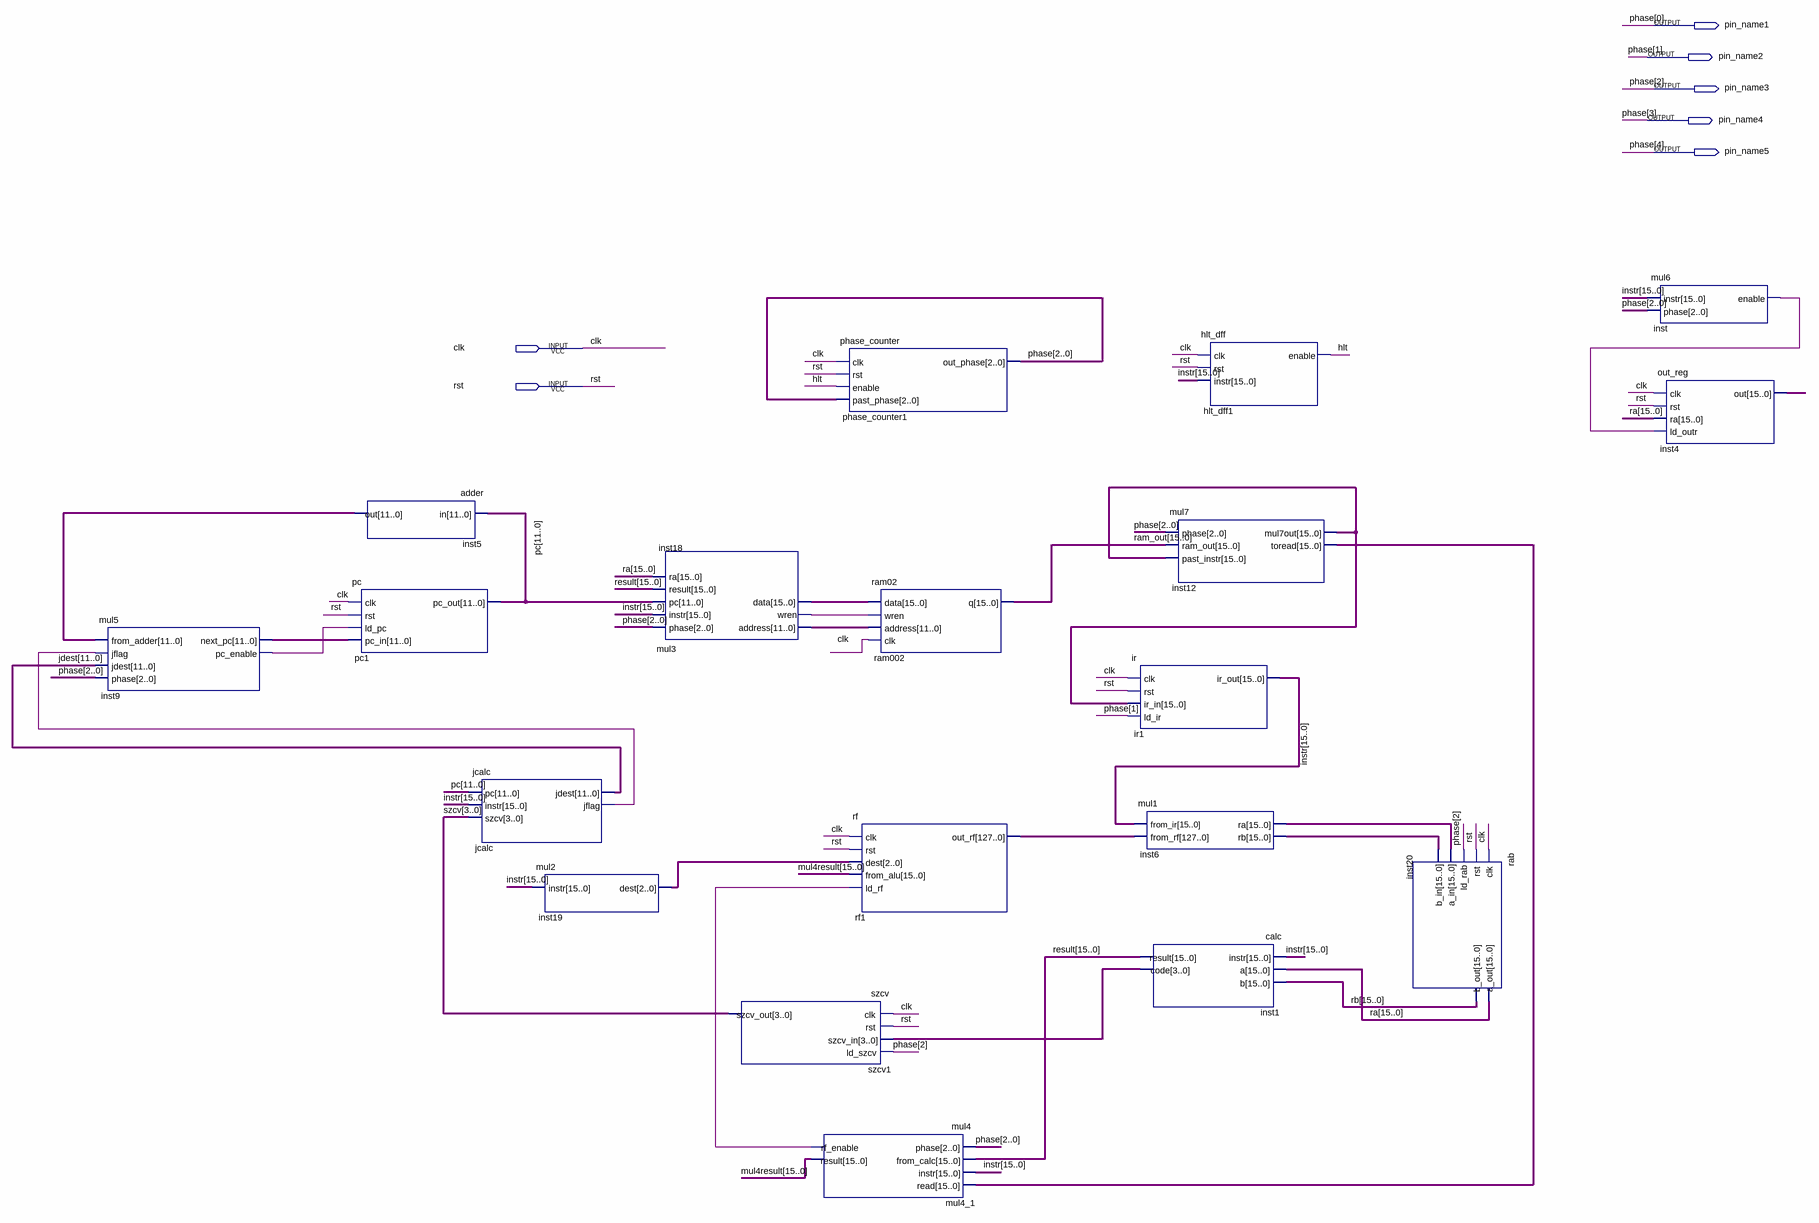
[diagram p0: schematic sheet]
// Quartus schematic SIMPLE.bdf as structural Verilog: 19 symbols, 7 pins
module SIMPLE (
  input  clk,
  input  rst,
  output pin_name1,
  output pin_name2,
  output pin_name3,
  output pin_name4,
  output pin_name5
);

  wire hlt, inst9_pc_enable, inst18_wren, inst_enable, jcalc_jflag, mul4_1_rf_enable;
  wire [2:0] inst19_dest;
  wire [3:0] inst1_code, szcv;
  wire [11:0] inst5_out, inst9_next_pc, inst18_address, jdest, pc;
  wire [15:0] inst4_out, inst6_ra, inst6_rb, inst12_mul7out, inst12_toread, inst18_data, instr, mul4result,
       ra, ram_out, rb, result;
  wire [127:0] rf1_out_rf;

  mul5 inst9 (
    .from_adder(inst5_out), .jflag(jcalc_jflag), .jdest(jdest), .phase({pin_name3, pin_name2, pin_name1}),
    .next_pc(inst9_next_pc), .pc_enable(inst9_pc_enable));
  adder inst5 (.in(pc), .out(inst5_out));
  pc pc1 (.clk(clk), .rst(rst), .ld_pc(inst9_pc_enable), .pc_in(inst9_next_pc), .pc_out(pc));
  jcalc jcalc (.pc(pc), .instr(instr), .szcv(szcv), .jdest(jdest), .jflag(jcalc_jflag));
  mul2 inst19 (.instr(instr), .dest(inst19_dest));
  mul3 inst18 (
    .phase({pin_name3, pin_name2, pin_name1}), .instr(instr), .pc(pc), .result(result), .ra(ra),
    .address(inst18_address), .wren(inst18_wren), .data(inst18_data));
  szcv szcv1 (.clk(clk), .rst(rst), .szcv_in(inst1_code), .ld_szcv(pin_name3), .szcv_out(szcv));
  mul4 mul4_1 (
    .phase({pin_name3, pin_name2, pin_name1}), .from_calc(result), .instr(instr), .read(inst12_toread),
    .rf_enable(mul4_1_rf_enable), .result(mul4result));
  phase_counter phase_counter1 (
    .clk(clk), .rst(rst), .enable(hlt), .past_phase({pin_name3, pin_name2, pin_name1}),
    .out_phase({pin_name3, pin_name2, pin_name1}));
  ram02 ram002 (.data(inst18_data), .wren(inst18_wren), .address(inst18_address), .clk(clk), .q(ram_out));
  rf rf1 (
    .clk(clk), .rst(rst), .dest(inst19_dest), .from_alu(mul4result), .ld_rf(mul4_1_rf_enable),
    .out_rf(rf1_out_rf));
  ir ir1 (.clk(clk), .rst(rst), .ir_in(inst12_mul7out), .ld_ir(pin_name2), .ir_out(instr));
  mul7 inst12 (
    .phase({pin_name3, pin_name2, pin_name1}), .ram_out(ram_out), .past_instr(inst12_mul7out),
    .mul7out(inst12_mul7out), .toread(inst12_toread));
  mul1 inst6 (.from_ir(instr), .from_rf(rf1_out_rf), .ra(inst6_ra), .rb(inst6_rb));
  calc inst1 (.instr(instr), .a(ra), .b(rb), .result(result), .code(inst1_code));
  hlt_dff hlt_dff1 (.clk(clk), .rst(rst), .instr(instr), .enable(hlt));
  rab inst20 (.clk(clk), .rst(rst), .ld_rab(pin_name3), .a_in(inst6_ra), .b_in(inst6_rb), .a_out(ra), .b_out(rb));
  mul6 inst (.instr(instr), .phase({pin_name3, pin_name2, pin_name1}), .enable(inst_enable));
  out_reg inst4 (.clk(clk), .rst(rst), .ra(ra), .ld_outr(inst_enable), .out(inst4_out));

  // Other names for the same wires on the sheet: phase[4:0] = {pin_name5, pin_name4, pin_name3, pin_name2, pin_name1}
endmodule
